# EAGLE schematic schematic (EAGLE 9.6.2)

## Sheet 1 of 8: Connections
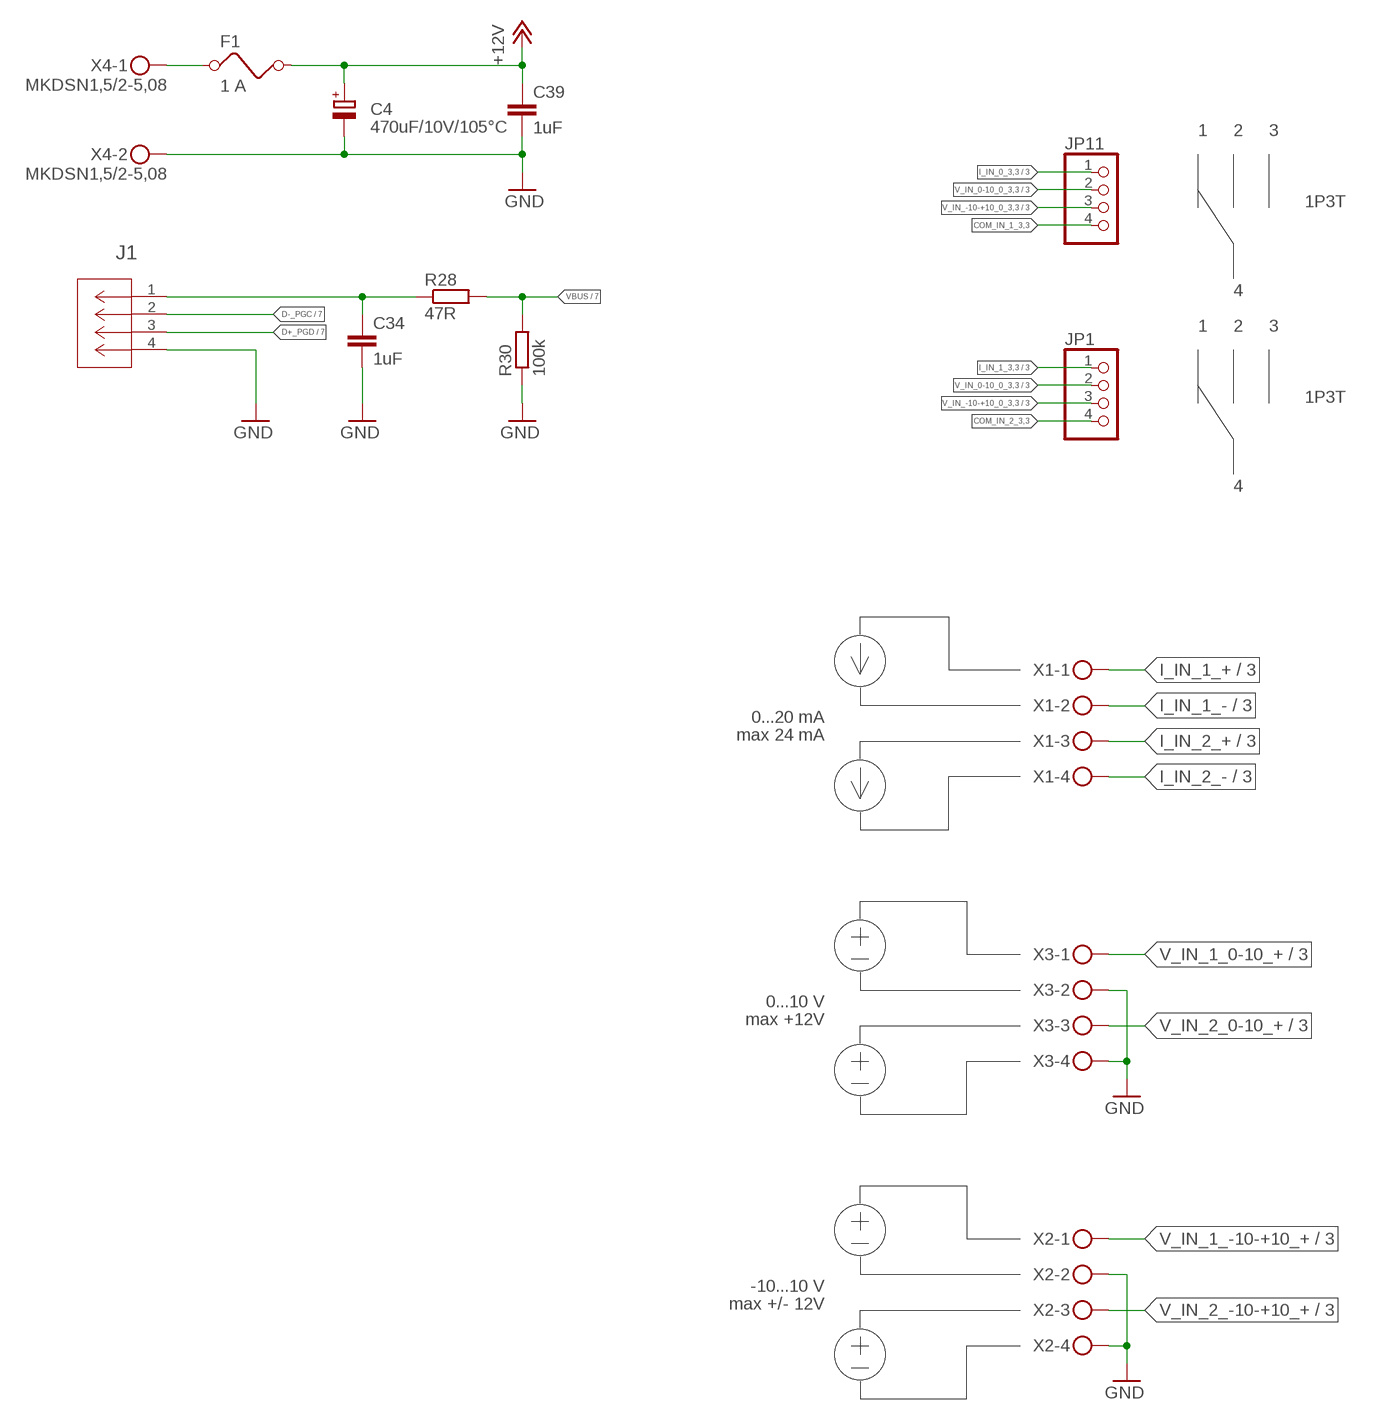
[diagram p0: schematic, sheet 1]

### Parts
C4  470uF/10V/105°C  CPOL-EUE3.5-8  [E3,5-8]
C34  1uF  C-EUC0805  [C0805]
C39  1uF  C-EUC0805  [C0805]
F1  1 A  FUSE  [FUSE]
J1  USB-B  [CONN_67068-8000_MOL]
JP1  PINHD-1X4  [1X04]
JP11  PINHD-1X4  [1X04]
R28  47R  R-EU_M0805  [M0805]
R30  100k  R-EU_M0805  [M0805]
X1  MKDSN1,5/4-5,08  [MKDSN1,5/4-5,08]
X2  MKDSN1,5/4-5,08  [MKDSN1,5/4-5,08]
X3  MKDSN1,5/4-5,08  [MKDSN1,5/4-5,08]
X4  MKDSN1,5/2-5,08  [MKDSN1,5/2-5,08]

### Nets
+12V: C4.+ C39.1 F1.2 ; also sheet 3,4,8
COM_IN_1_3,3: JP11.4
COM_IN_2_3,3: JP1.4
D+_PGD: J1.3 ; also sheet 7
D-_PGC: J1.2 ; also sheet 7
GND: C4.- C34.2 C39.2 J1.4 R30.1 X2.2 X2.4 X3.2 X3.4 X4.2 ; also sheet 2,3,4,5,6,7,8
I_IN_0_3,3: JP11.1 ; also sheet 3,7
I_IN_1_3,3: JP1.1 ; also sheet 3,7
I_IN_1_+: X1.1 ; also sheet 3
I_IN_1_-: X1.2 ; also sheet 3
I_IN_2_+: X1.3 ; also sheet 3
I_IN_2_-: X1.4 ; also sheet 3
N$12: C34.1 J1.1 R28.1
N$22: F1.1 X4.1
V_IN_0-10_0_3,3: JP1.2 JP11.2 ; also sheet 3,7
V_IN_1_0-10_+: X3.1 ; also sheet 3
V_IN_1_-10-+10_+: X2.1 ; also sheet 3
V_IN_2_0-10_+: X3.3 ; also sheet 3
V_IN_2_-10-+10_+: X2.3 ; also sheet 3
V_IN_-10-+10_0_3,3: JP1.3 JP11.3 ; also sheet 3,7
VBUS: R28.2 R30.2 ; also sheet 7

### Notes on the sheet
- 1 | 2 | 3
- 1P3T
- 4
- 1 | 2 | 3
- 1P3T
- 4
- 0...20 mA
- max 24 mA
- 0...10 V
- max +12V
- -10...10 V
- max +/- 12V

## Sheet 2 of 8: Voltage References
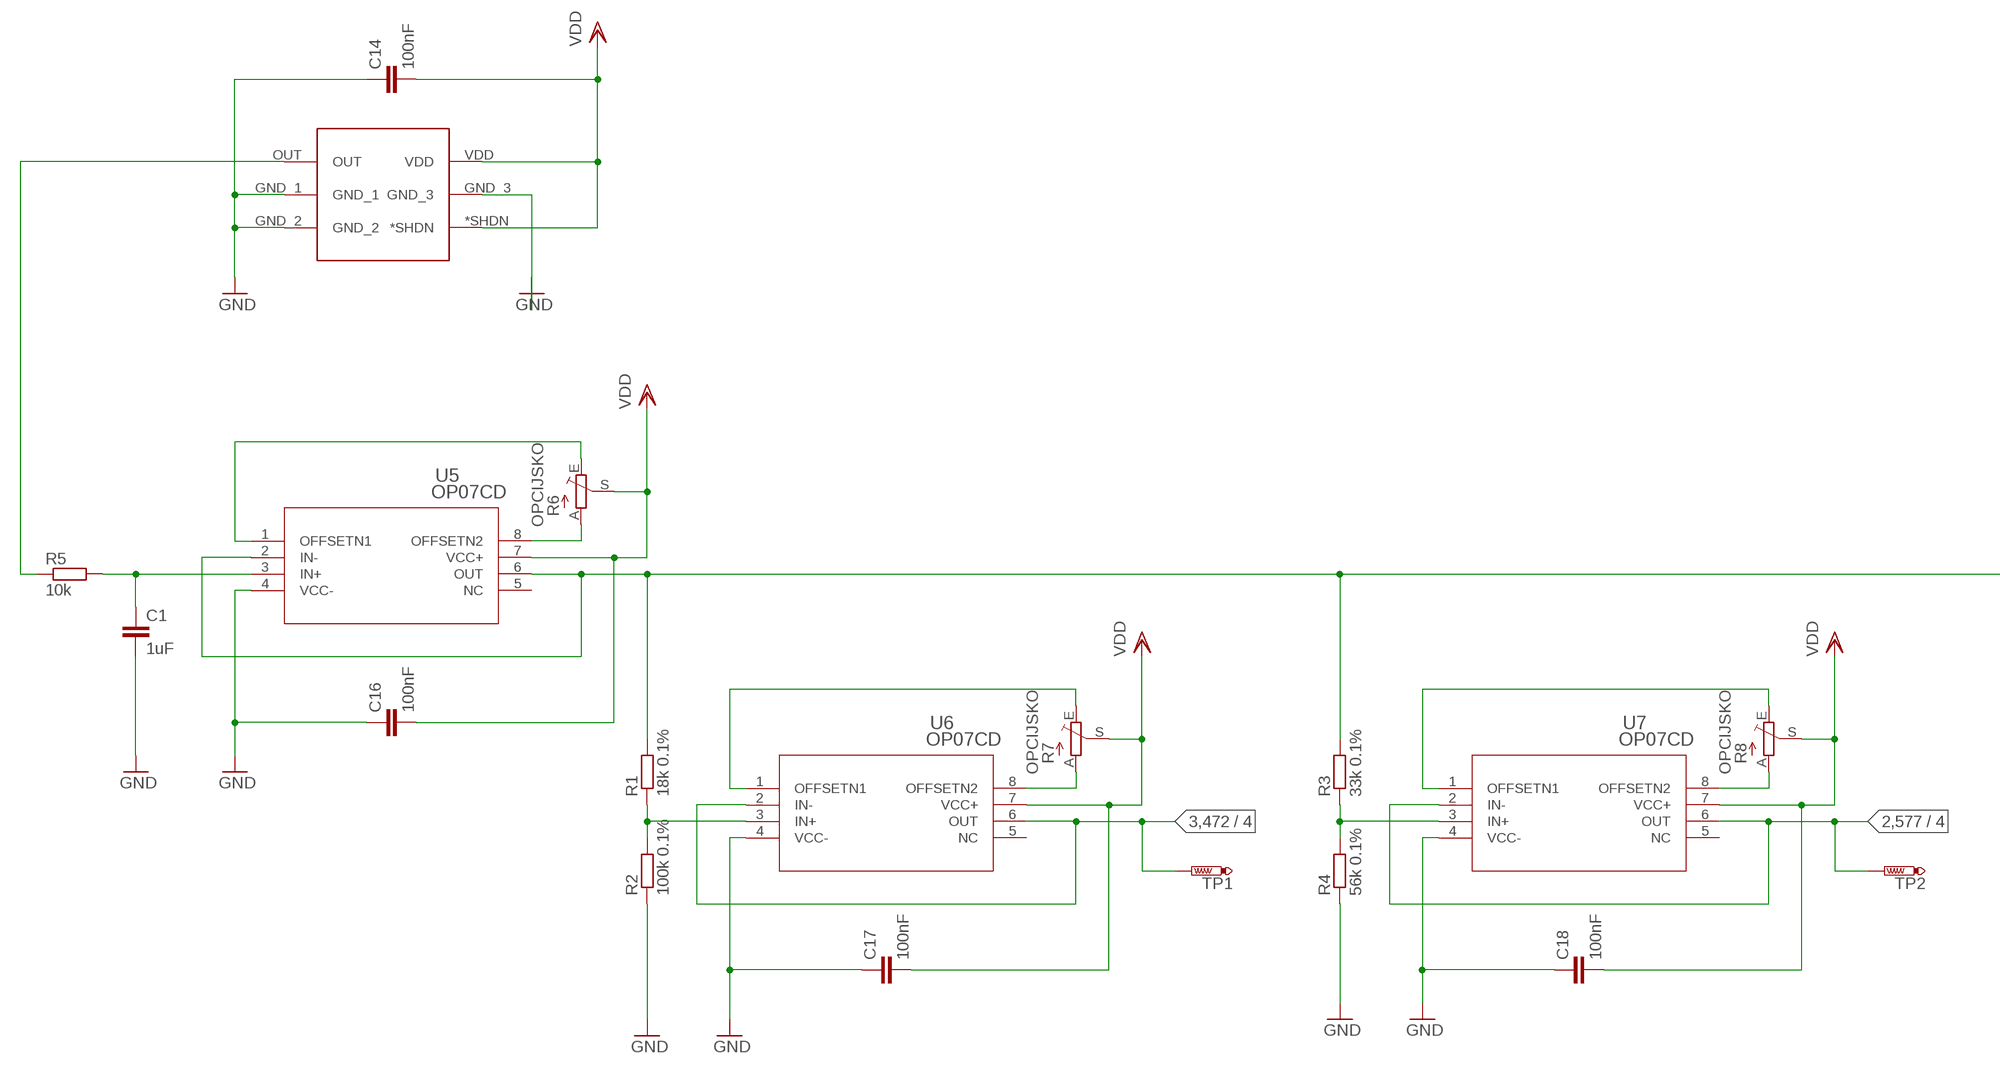
[diagram p1: schematic, sheet 2, part 1 of 2]
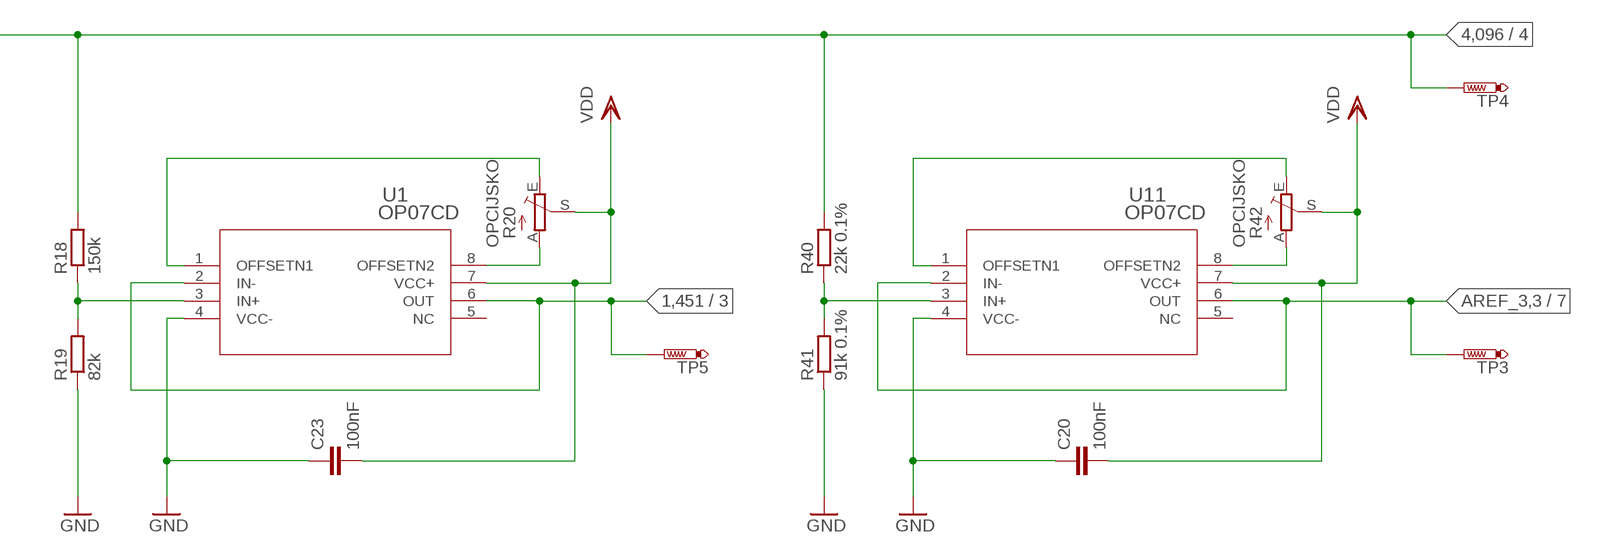
[diagram p2: schematic, sheet 2, part 2 of 2]

### Parts
C1  1uF  C-EUC0805  [C0805]
C14  100nF  C-EUC0805  [C0805]
C16  100nF  C-EUC0805  [C0805]
C17  100nF  C-EUC0805  [C0805]
C18  100nF  C-EUC0805  [C0805]
C20  100nF  C-EUC0805  [C0805]
C23  100nF  C-EUC0805  [C0805]
R1  18k 0.1%  R-EU_R0805  [R0805]
R2  100k 0.1%  R-EU_R0805  [R0805]
R3  33k 0.1%  R-EU_R0805  [R0805]
R4  56k 0.1%  R-EU_R0805  [R0805]
R5  10k  R-EU_R0805  [R0805]
R6  TRIM_EU-S64W  [S64W]
R7  TRIM_EU-S64W  [S64W]
R8  TRIM_EU-S64W  [S64W]
R18  150k  R-EU_R0805  [R0805]
R19  82k  R-EU_R0805  [R0805]
R20  TRIM_EU-S64W  [S64W]
R40  22k 0.1%  R-EU_R0805  [R0805]
R41  91k 0.1%  R-EU_R0805  [R0805]
R42  TRIM_EU-S64W  [S64W]
TP1  PTR1PAD1-13  [P1-13]
TP2  PTR1PAD1-13  [P1-13]
TP3  PTR1PAD1-13  [P1-13]
TP4  PTR1PAD1-13  [P1-13]
TP5  PTR1PAD1-13  [P1-13]
U1  OP07CD  [D8]
U4  MCP1501T-40E/CHY  [SOT26]
U5  OP07CD  [D8]
U6  OP07CD  [D8]
U7  OP07CD  [D8]
U11  OP07CD  [D8]

### Nets
1,451: TP5.TP U1.2(IN-) U1.6(OUT) ; also sheet 3
2,577: TP2.TP U7.2(IN-) U7.6(OUT) ; also sheet 4
3,472: TP1.TP U6.2(IN-) U6.6(OUT) ; also sheet 4
4,096: R1.2 R3.2 R18.2 R40.2 TP4.TP U5.2(IN-) U5.6(OUT) ; also sheet 4
AREF_3,3: TP3.TP U11.2(IN-) U11.6(OUT) ; also sheet 3,7
GND: C1.2 C14.1 C16.1 C17.1 C18.1 C20.1 C23.1 R2.1 R4.1 R19.1 R41.1 U1.4(VCC-) U4.GND_1 U4.GND_2 U4.GND_3 U5.4(VCC-) U6.4(VCC-) U7.4(VCC-) U11.4(VCC-) ; also sheet 1,3,4,5,6,7,8
N$1: R3.1 R4.2 U7.3(IN+)
N$2: R6.A U5.8(OFFSETN2)
N$3: C1.1 R5.2 U5.3(IN+)
N$4: R6.E U5.1(OFFSETN1)
N$5: R5.1 U4.OUT
N$6: R1.1 R2.2 U6.3(IN+)
N$7: R7.A U6.8(OFFSETN2)
N$8: R7.E U6.1(OFFSETN1)
N$9: R8.A U7.8(OFFSETN2)
N$10: R8.E U7.1(OFFSETN1)
N$23: R18.1 R19.2 U1.3(IN+)
N$24: R20.A U1.8(OFFSETN2)
N$27: R20.E U1.1(OFFSETN1)
N$40: R40.1 R41.2 U11.3(IN+)
N$44: R42.A U11.8(OFFSETN2)
N$45: R42.E U11.1(OFFSETN1)
VDD: C14.2 C16.2 C17.2 C18.2 C20.2 C23.2 R6.S R7.S R8.S R20.S R42.S U1.7(VCC+) U4.*SHDN U4.VDD U5.7(VCC+) U6.7(VCC+) U7.7(VCC+) U11.7(VCC+) ; also sheet 3,4,8
Unconnected: U1.5(NC) U5.5(NC) U6.5(NC) U7.5(NC) U11.5(NC)

### Notes on the sheet
- OPCIJSKO
- OPCIJSKO | OPCIJSKO | OPCIJSKO | OPCIJSKO

## Sheet 3 of 8: Analog inputs
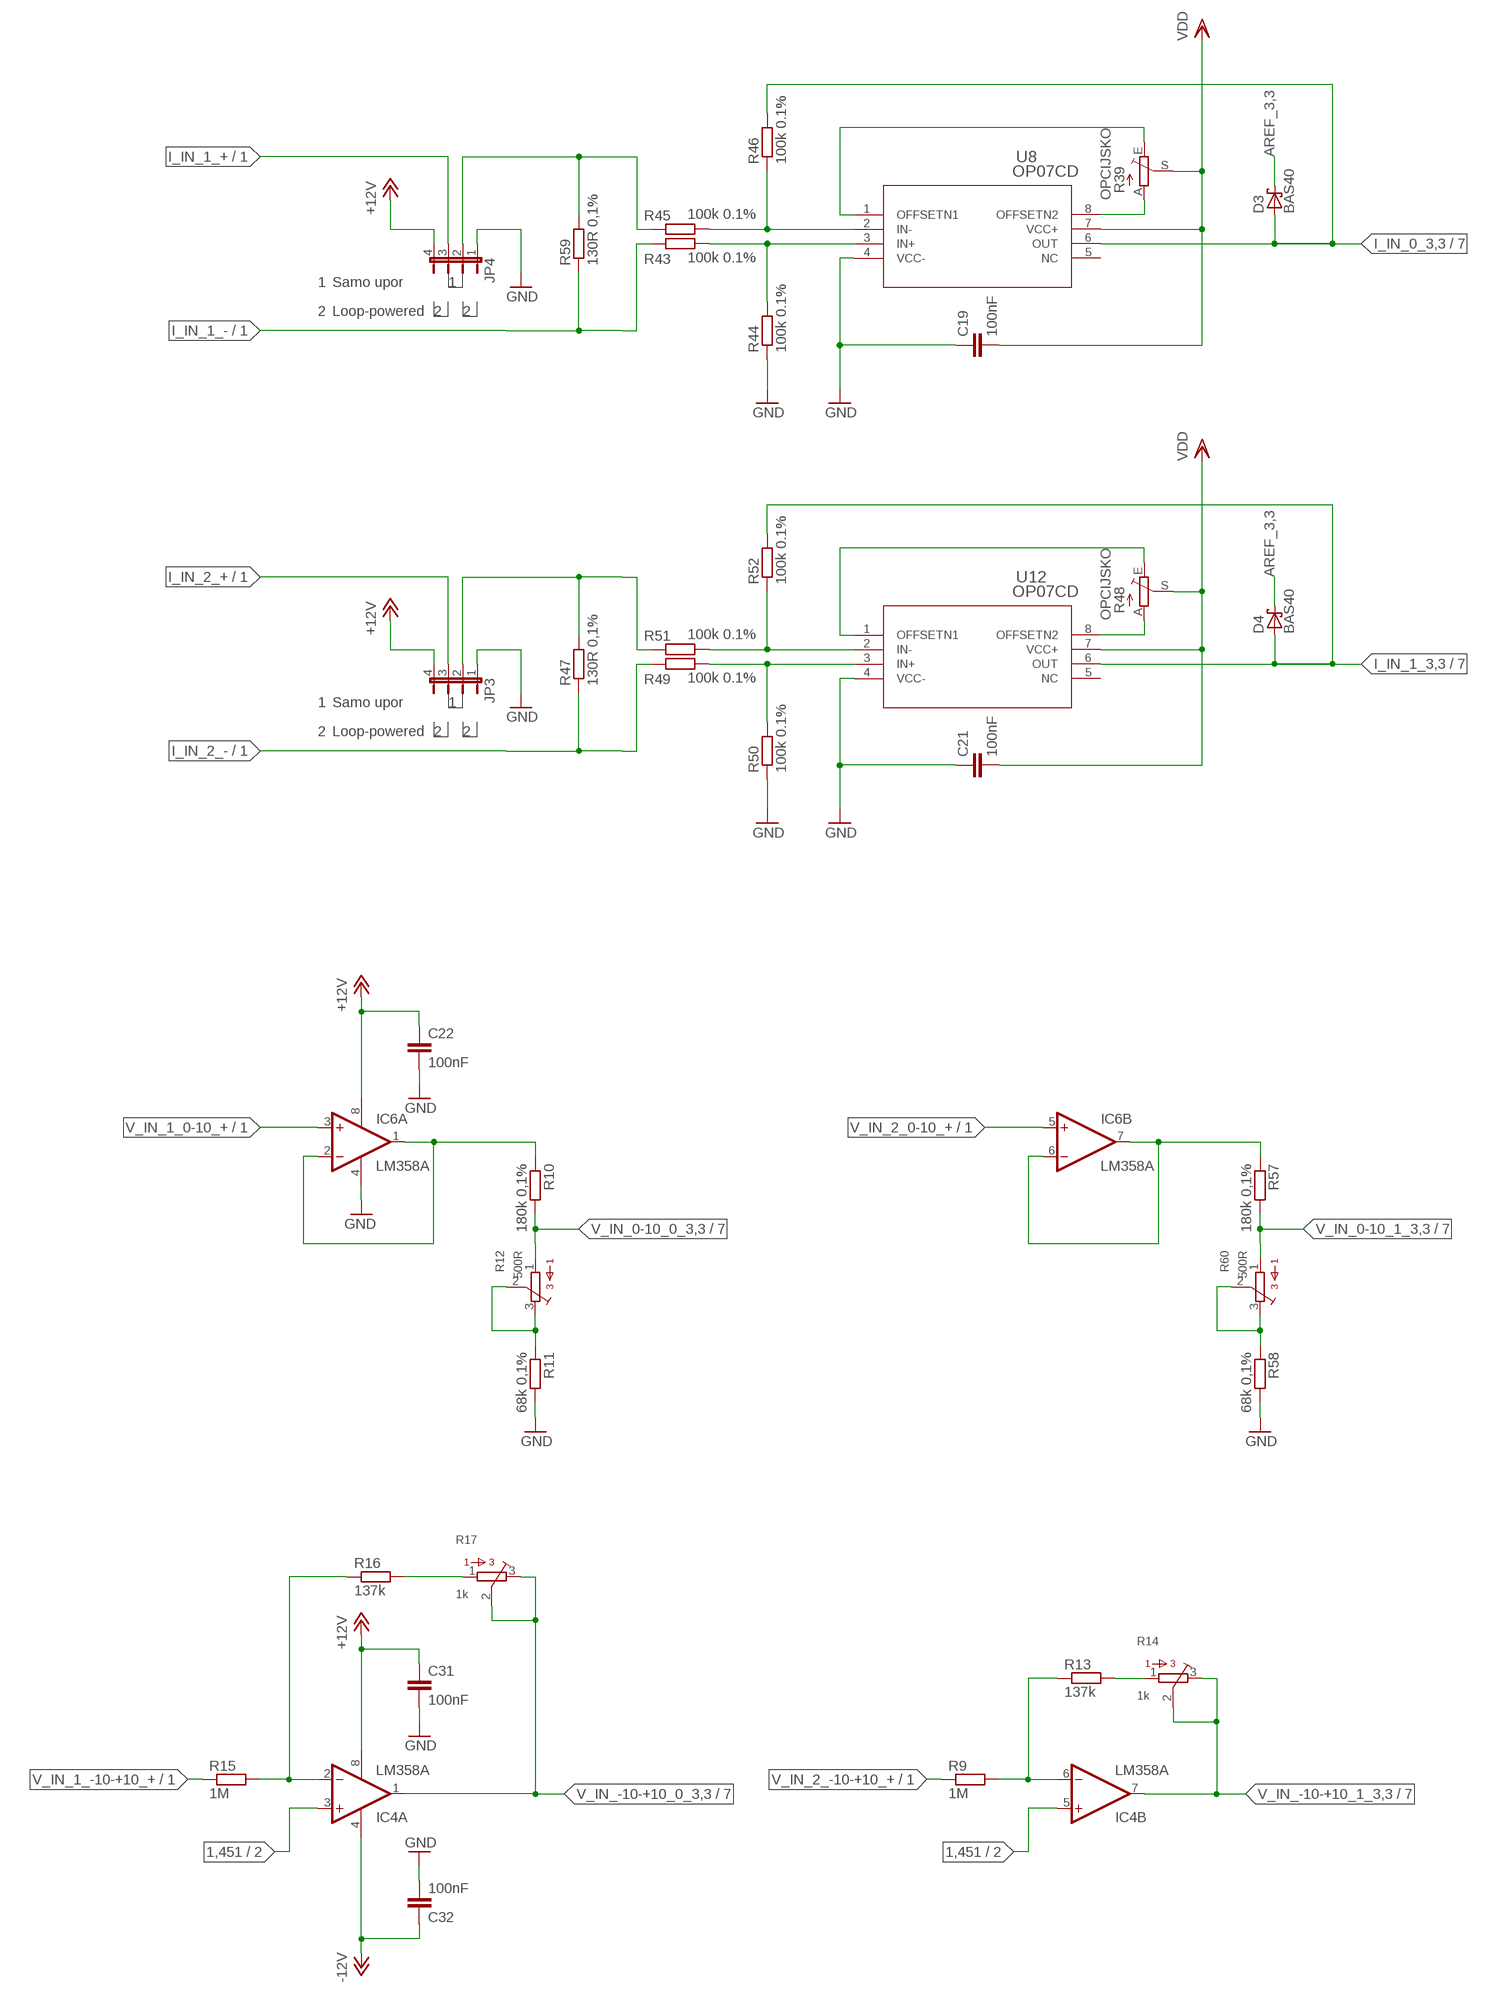
[diagram p3: schematic, sheet 3]

### Parts
C19  100nF  C-EUC0805  [C0805]
C21  100nF  C-EUC0805  [C0805]
C22  100nF  C-EUC0805  [C0805]
C31  100nF  C-EUC0805  [C0805]
C32  100nF  C-EUC0805  [C0805]
D3  BAS40  [SOT23]
D4  BAS40  [SOT23]
IC4  LM358A  LM358D  [SO08]
IC6  LM358A  LM358D  [SO08]
JP3  JP4E  [JP4]
JP4  JP4E  [JP4]
R9  1M  R-EU_R0805  [R0805]
R10  180k 0,1%  R-EU_R0805  [R0805]
R11  68k 0,1%  R-EU_R0805  [R0805]
R12  500R  3362P  [3362P]
R13  137k  R-EU_R0805  [R0805]
R14  1k  3362P  [3362P]
R15  1M  R-EU_R0805  [R0805]
R16  137k  R-EU_R0805  [R0805]
R17  1k  3362P  [3362P]
R39  TRIM_EU-S64W  [S64W]
R43  100k 0.1%  R-EU_R0805  [R0805]
R44  100k 0.1%  R-EU_R0805  [R0805]
R45  100k 0.1%  R-EU_R0805  [R0805]
R46  100k 0.1%  R-EU_R0805  [R0805]
R47  130R 0,1%  R-EU_R0805  [R0805]
R48  TRIM_EU-S64W  [S64W]
R49  100k 0.1%  R-EU_R0805  [R0805]
R50  100k 0.1%  R-EU_R0805  [R0805]
R51  100k 0.1%  R-EU_R0805  [R0805]
R52  100k 0.1%  R-EU_R0805  [R0805]
R57  180k 0,1%  R-EU_R0805  [R0805]
R58  68k 0,1%  R-EU_R0805  [R0805]
R59  130R 0,1%  R-EU_R0805  [R0805]
R60  500R  3362P  [3362P]
U8  OP07CD  [D8]
U12  OP07CD  [D8]

### Nets
1,451: IC4.3(A:+IN) IC4.5(B:+IN) ; also sheet 2
+12V: C22.1 C31.1 IC4.8(P:V+) IC6.8(P:V+) JP3.4 JP4.4 ; also sheet 1,4,8
-12V: C32.1 IC4.4(P:V-) ; also sheet 4,8
AREF_3,3: D3.3(C) D4.3(C) ; also sheet 2,7
GND: C19.1 C21.1 C22.2 C31.2 C32.2 IC6.4(P:V-) JP3.1 JP4.1 R11.2 R44.1 R50.1 R58.2 U8.4(VCC-) U12.4(VCC-) ; also sheet 1,2,4,5,6,7,8
I_IN_0_3,3: D3.1(A) R46.2 U8.6(OUT) ; also sheet 1,7
I_IN_1_3,3: D4.1(A) R52.2 U12.6(OUT) ; also sheet 1,7
I_IN_1_+: JP4.3 ; also sheet 1
I_IN_2_+: JP3.3 ; also sheet 1
N$14: R16.2 R17.1
N$20: IC4.2(A:-IN) R15.2 R16.1
N$25 [signal]: IC6.1(A:OUT) IC6.2(A:-IN) R10.1
N$26: R11.1 R12.2 R12.3
N$28: IC4.6(B:-IN) R9.2 R13.1
N$35: R13.2 R14.1
N$41: R39.A U8.8(OFFSETN2)
N$43: R39.E U8.1(OFFSETN1)
N$46: R45.1 R46.1 U8.2(IN-)
N$47: R43.2 R44.2 U8.3(IN+)
N$48 [signal]: JP3.2 R47.2 R51.2
N$49 [signal]: R47.1 R49.1
N$50: R48.A U12.8(OFFSETN2)
N$51: R48.E U12.1(OFFSETN1)
N$52: R51.1 R52.1 U12.2(IN-)
N$53: R49.2 R50.2 U12.3(IN+)
N$55: R58.1 R60.2 R60.3
N$89 [signal]: JP4.2 R45.2 R59.2
N$93 [signal]: IC6.6(B:-IN) IC6.7(B:OUT) R57.1
N$96 [signal]: R43.1 R59.1
V_IN_0-10_0_3,3: R10.2 R12.1 ; also sheet 1,7
V_IN_0-10_1_3,3: R57.2 R60.1 ; also sheet 7
V_IN_1_0-10_+: IC6.3(A:+IN) ; also sheet 1
V_IN_1_-10-+10_+: R15.1 ; also sheet 1
V_IN_2_0-10_+: IC6.5(B:+IN) ; also sheet 1
V_IN_2_-10-+10_+: R9.1 ; also sheet 1
V_IN_-10-+10_0_3,3: IC4.1(A:OUT) R17.2 R17.3 ; also sheet 1,7
V_IN_-10-+10_1_3,3: IC4.7(B:OUT) R14.2 R14.3 ; also sheet 7
VDD: C19.2 C21.2 R39.S R48.S U8.7(VCC+) U12.7(VCC+) ; also sheet 2,4,8
Unconnected: U8.5(NC) U12.5(NC)

### Notes on the sheet
- OPCIJSKO
- 1 | Samo upor | 1
- 2 | Loop-powered | 2 | 2
- OPCIJSKO
- 1 | Samo upor | 1
- 2 | Loop-powered | 2 | 2

## Sheet 4 of 8: Analog Outputs
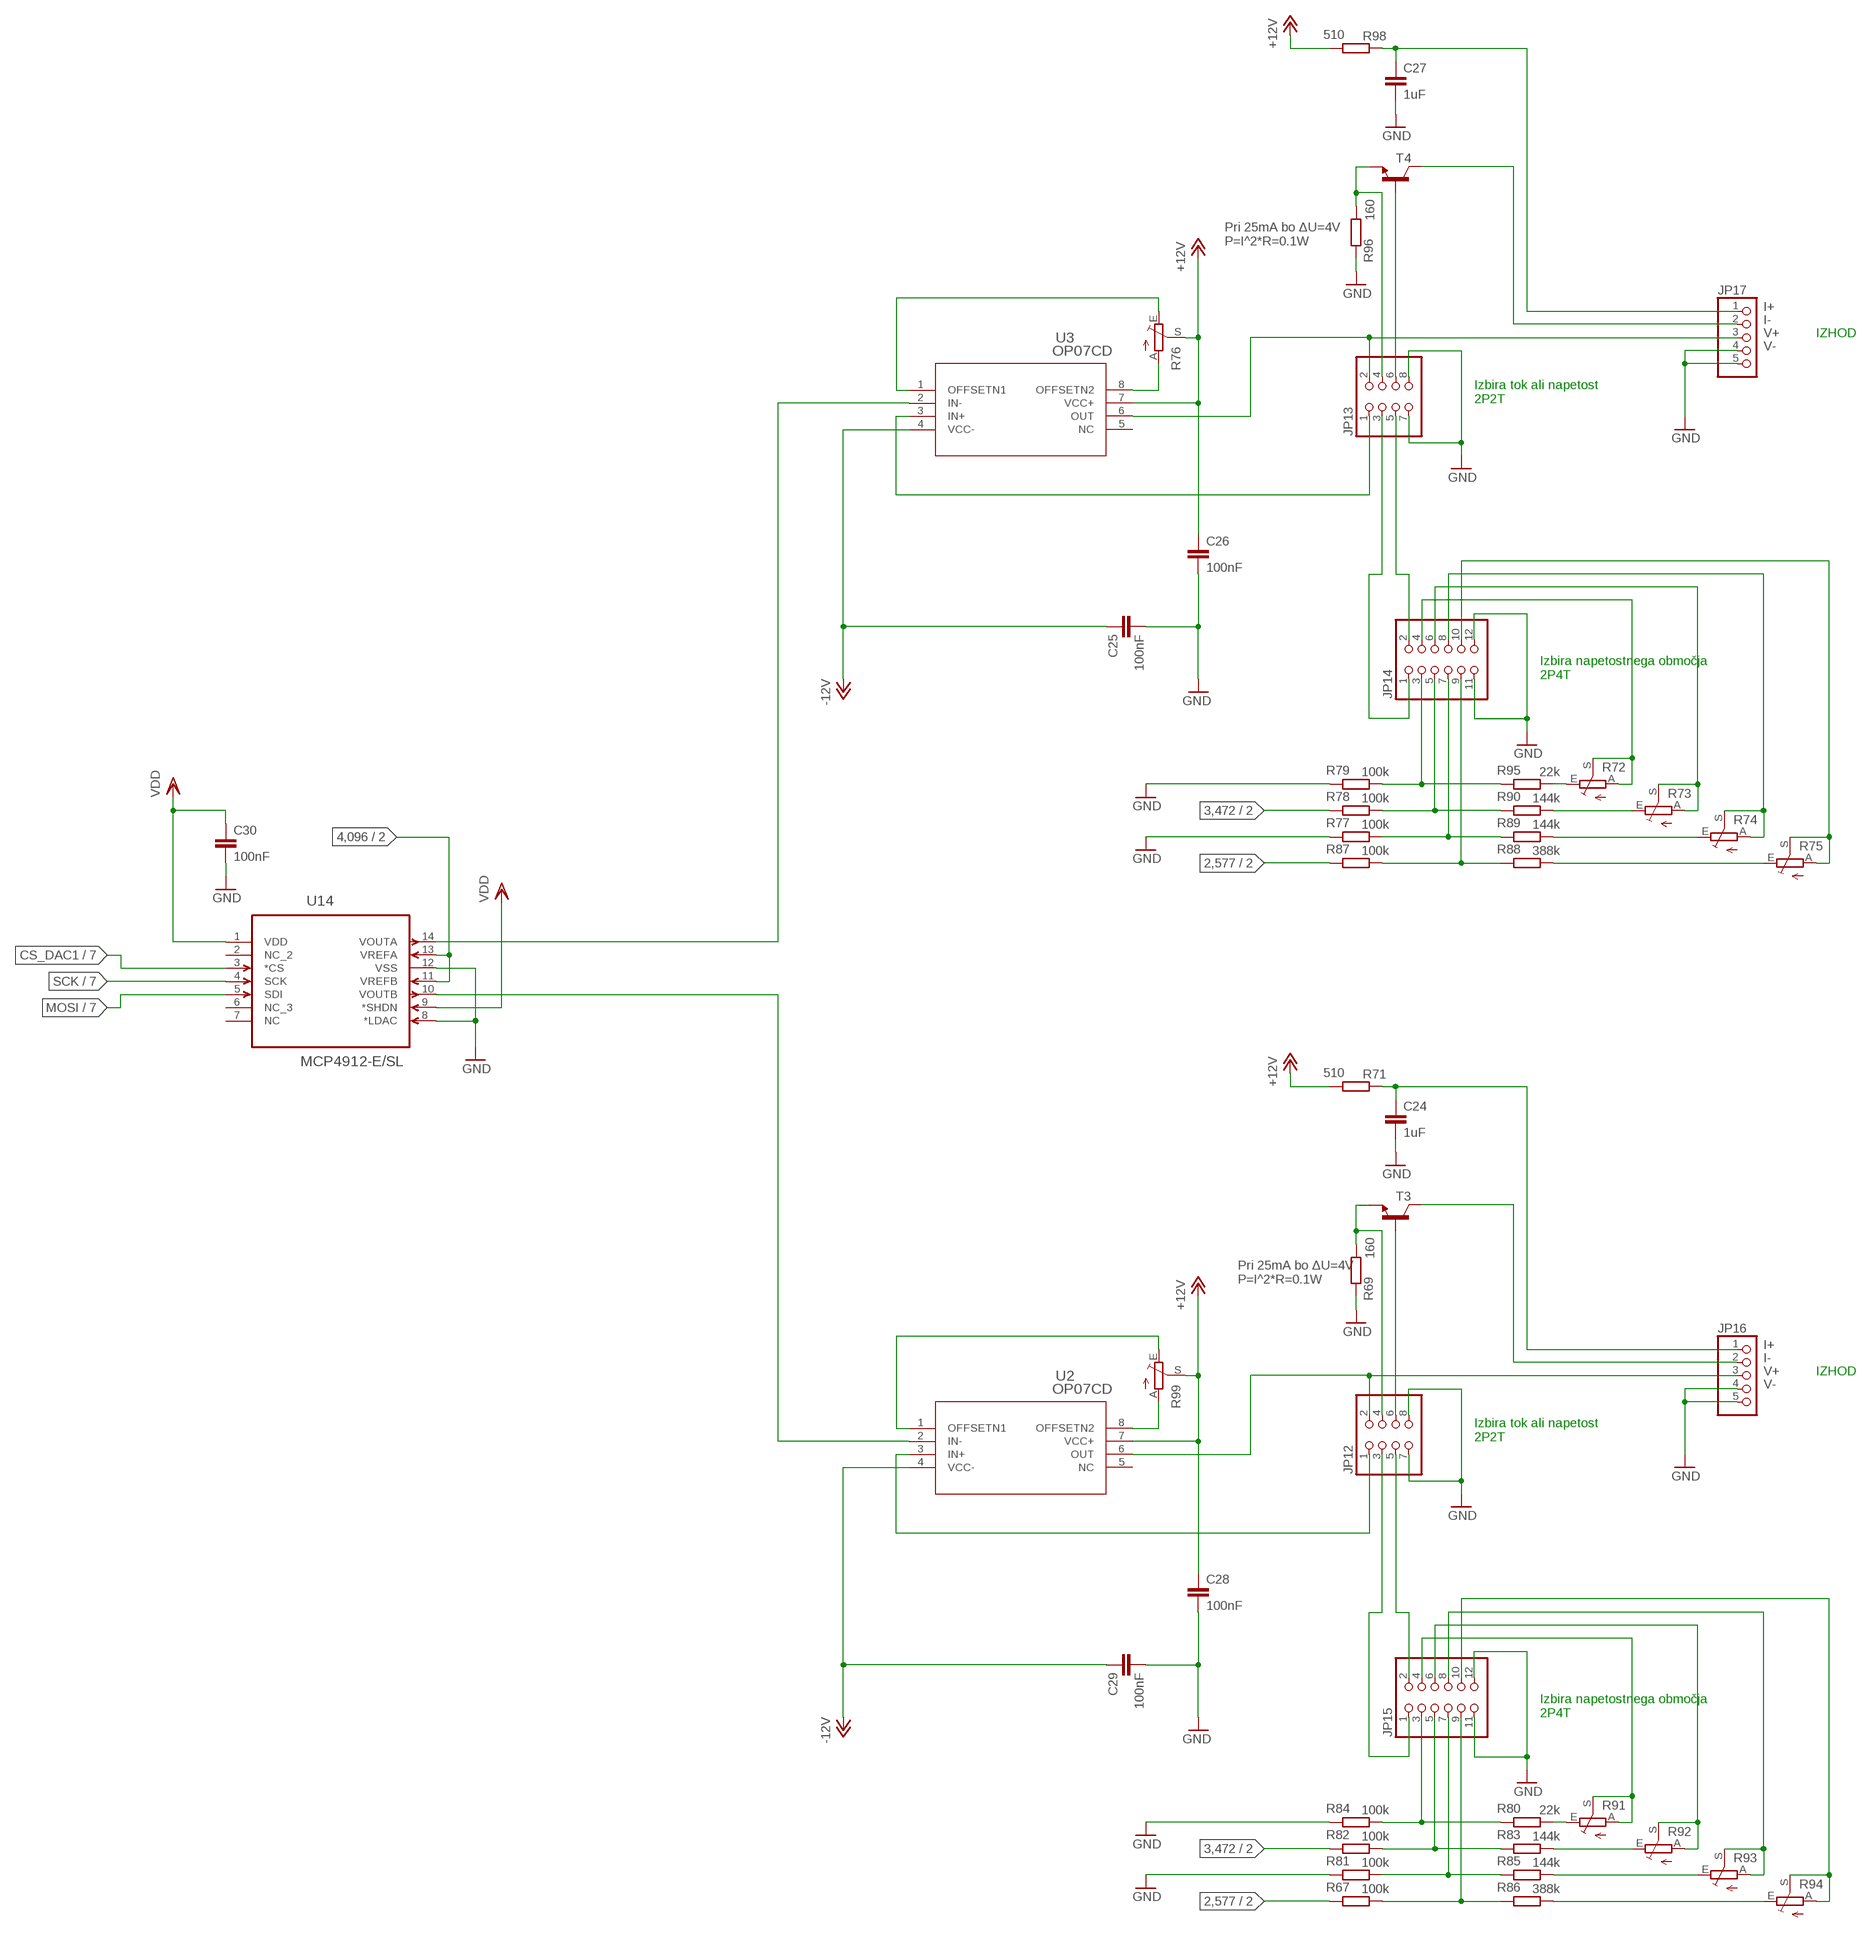
[diagram p4: schematic, sheet 4]

### Parts
C24  1uF  C-EUC0805  [C0805]
C25  100nF  C-EUC0805  [C0805]
C26  100nF  C-EUC0805  [C0805]
C27  1uF  C-EUC0805  [C0805]
C28  100nF  C-EUC0805  [C0805]
C29  100nF  C-EUC0805  [C0805]
C30  100nF  C-EUC0805  [C0805]
JP12  PINHD-2X4  [2X04]
JP13  PINHD-2X4  [2X04]
JP14  PINHD-2X6  [2X06]
JP15  PINHD-2X6  [2X06]
JP16  PINHD-1X5  [1X05]
JP17  PINHD-1X5  [1X05]
R67  100k  R-EU_R0805  [R0805]
R69  160  R-EU_R0805  [R0805]
R71  510  R-EU_R0805  [R0805]
R72  TRIM_EU-S64W  [S64W]
R73  TRIM_EU-S64W  [S64W]
R74  TRIM_EU-S64W  [S64W]
R75  TRIM_EU-S64W  [S64W]
R76  TRIM_EU-S64W  [S64W]
R77  100k  R-EU_R0805  [R0805]
R78  100k  R-EU_R0805  [R0805]
R79  100k  R-EU_R0805  [R0805]
R80  22k  R-EU_R0805  [R0805]
R81  100k  R-EU_R0805  [R0805]
R82  100k  R-EU_R0805  [R0805]
R83  144k  R-EU_R0805  [R0805]
R84  100k  R-EU_R0805  [R0805]
R85  144k  R-EU_R0805  [R0805]
R86  388k  R-EU_R0805  [R0805]
R87  100k  R-EU_R0805  [R0805]
R88  388k  R-EU_R0805  [R0805]
R89  144k  R-EU_R0805  [R0805]
R90  144k  R-EU_R0805  [R0805]
R91  TRIM_EU-S64W  [S64W]
R92  TRIM_EU-S64W  [S64W]
R93  TRIM_EU-S64W  [S64W]
R94  TRIM_EU-S64W  [S64W]
R95  22k  R-EU_R0805  [R0805]
R96  160  R-EU_R0805  [R0805]
R98  510  R-EU_R0805  [R0805]
R99  TRIM_EU-S64W  [S64W]
T3  MMBT3904LT1-NPN-SOT23-BEC  [SOT23-BEC]
T4  MMBT3904LT1-NPN-SOT23-BEC  [SOT23-BEC]
U2  OP07CD  [D8]
U3  OP07CD  [D8]
U14  MCP4912-E/SL  [SOIC127P600X175-16N]

### Nets
2,577: R67.2 R87.2 ; also sheet 2
3,472: R78.2 R82.2 ; also sheet 2
4,096: U14.11(VREFB) U14.13(VREFA) ; also sheet 2
+12V: C26.1 C28.1 R71.1 R76.S R98.1 R99.S U2.7(VCC+) U3.7(VCC+) ; also sheet 1,3,8
-12V: C25.1 C29.1 U2.4(VCC-) U3.4(VCC-) ; also sheet 3,8
CS_DAC1: U14.3(*CS) ; also sheet 7
GND: C24.2 C25.2 C26.2 C27.2 C28.2 C29.2 C30.2 JP12.7 JP12.8 JP13.7 JP13.8 JP14.11 JP14.12 JP15.11 JP15.12 R69.2 R77.2 R79.2 R81.2 R84.2 R96.2 U14.8(*LDAC) U14.12(VSS) ; also sheet 1,2,3,5,6,7,8
I+: C24.1 C27.1 JP16.1 JP17.1 R71.2 R98.2
I-: JP16.2 JP17.2 T3.C T4.C
MOSI: U14.5(SDI) ; also sheet 7
N$59: R99.A U2.8(OFFSETN2)
N$64: U14.14(VOUTA)
N$65: U3.2(IN-)
N$66: U2.2(IN-) U14.10(VOUTB)
N$68: JP13.4 R96.1 T4.E
N$71: JP14.3 R79.1 R95.2
N$72: JP14.7 R77.1 R89.2
N$73: JP14.9 R87.1 R88.2
N$74: JP14.5 R78.1 R90.2
N$75: JP13.1 U3.3(IN+)
N$76: JP13.3 JP14.1
N$77: JP13.5 JP14.2
N$78: JP13.6 T4.B
N$79: R72.E R95.1
N$80: JP14.6 R73.A R73.S
N$81: JP14.4 R72.A R72.S
N$85: JP12.4 R69.1 T3.E
N$86: JP15.3 R80.2 R84.1
N$87: JP15.7 R81.1 R85.2
N$88: JP15.9 R67.1 R86.2
N$90: JP15.5 R82.1 R83.2
N$91: JP12.1 U2.3(IN+)
N$92: JP12.3 JP15.1
N$94: JP12.5 JP15.2
N$95: JP12.6 T3.B
N$97: R80.1 R91.E
N$98: JP15.6 R92.A R92.S
N$99: JP15.4 R91.A R91.S
N$100: JP15.8 R93.A R93.S
N$101: JP15.10 R94.A R94.S
N$102: R83.1 R92.E
N$103: R85.1 R93.E
N$104: R86.1 R94.E
N$105: JP14.8 R74.A R74.S
N$106: JP14.10 R75.A R75.S
N$107: R73.E R90.1
N$108: R74.E R89.1
N$109: R99.E U2.1(OFFSETN1)
N$110: R75.E R88.1
N$111: R76.A U3.8(OFFSETN2)
N$112: R76.E U3.1(OFFSETN1)
SCK: U14.4(SCK) ; also sheet 7
V+: JP12.2 JP13.2 JP16.3 JP17.3 U2.6(OUT) U3.6(OUT)
V-: JP16.4 JP16.5 JP17.4 JP17.5 ; supply symbol labelled GND
VDD: C30.1 U14.1(VDD) U14.9(*SHDN) ; also sheet 2,3,8
Unconnected: U2.5(NC) U3.5(NC) U14.2(NC_2) U14.6(NC_3) U14.7(NC)

### Notes on the sheet
- Pri 25mA bo ΔU=4V
  P=I^2*R=0.1W
- IZHOD
- Izbira tok ali napetost
  2P2T
- Izbira napetostnega območja
  2P4T
- Pri 25mA bo ΔU=4V
  P=I^2*R=0.1W
- IZHOD
- Izbira tok ali napetost
  2P2T
- Izbira napetostnega območja
  2P4T

## Sheet 5 of 8: Digital inputs
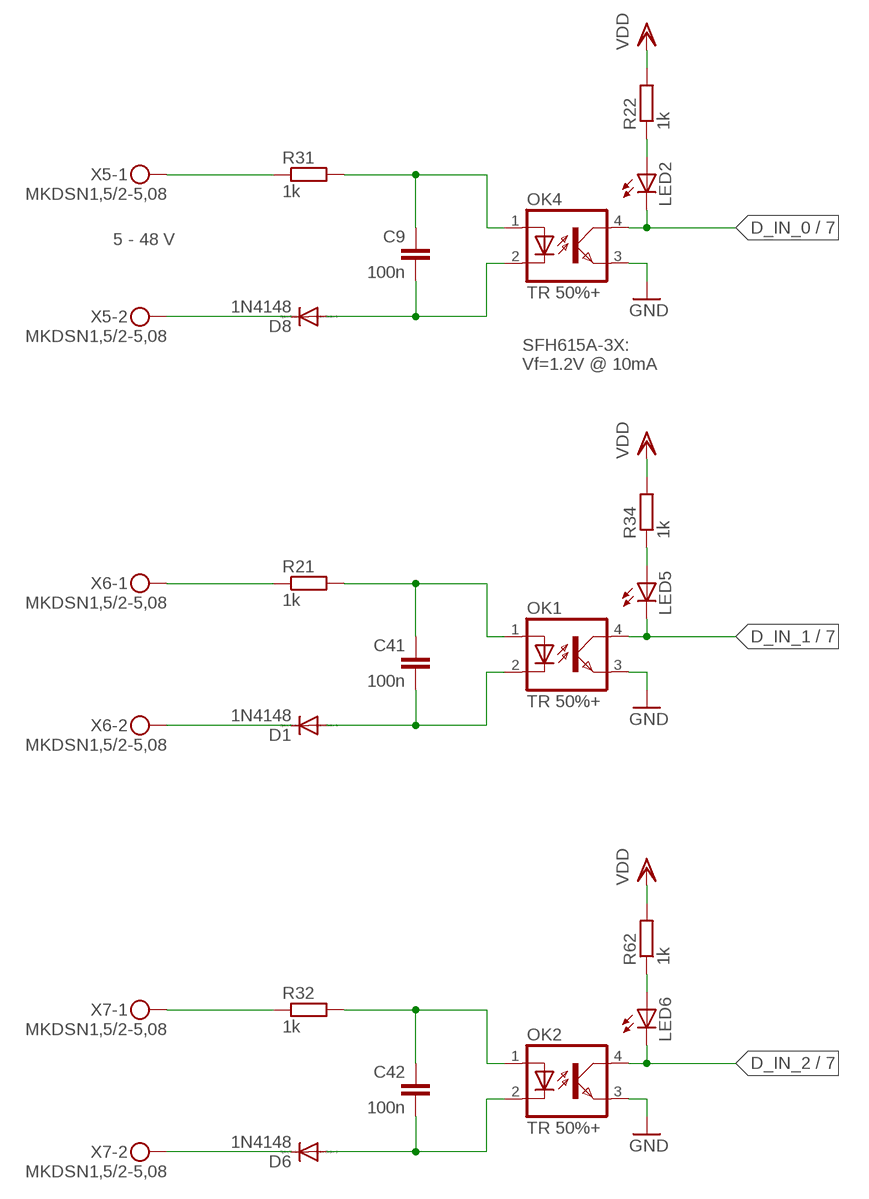
[diagram p5: schematic, sheet 5]

### Parts
C9  100n  C-EUC0805  [C0805]
C41  100n  C-EUC0805  [C0805]
C42  100n  C-EUC0805  [C0805]
D1  1N4148  [MINIMELF]
D6  1N4148  [MINIMELF]
D8  1N4148  [MINIMELF]
LED2  LEDCHIPLED_0805  [CHIPLED_0805]
LED5  LEDCHIPLED_0805  [CHIPLED_0805]
LED6  LEDCHIPLED_0805  [CHIPLED_0805]
OK1  TR 50%+  LTV816  [DIL04]
OK2  TR 50%+  LTV816  [DIL04]
OK4  TR 50%+  LTV816  [DIL04]
R21  1k  R-EU_R2512  [R2512]
R22  1k  R-EU_R0805  [R0805]
R31  1k  R-EU_R2512  [R2512]
R32  1k  R-EU_R2512  [R2512]
R34  1k  R-EU_R0805  [R0805]
R62  1k  R-EU_R0805  [R0805]
X5  MKDSN1,5/2-5,08  [MKDSN1,5/2-5,08]
X6  MKDSN1,5/2-5,08  [MKDSN1,5/2-5,08]
X7  MKDSN1,5/2-5,08  [MKDSN1,5/2-5,08]

### Nets
+5V [signal]: R22.2 R34.2 R62.2 ; supply symbol labelled VDD ; also sheet 8
D_IN_0: LED2.C OK4.4(COL) ; also sheet 7
D_IN_1: LED5.C OK1.4(COL) ; also sheet 7
D_IN_2: LED6.C OK2.4(COL) ; also sheet 7
GND: OK1.3(EMIT) OK2.3(EMIT) OK4.3(EMIT) ; also sheet 1,2,3,4,6,7,8
N$13: R21.1 X6.1
N$16 [signal]: LED2.A R22.1
N$17: C41.1 OK1.1(A) R21.2
N$21: C41.2 D1.A OK1.2(C)
N$29: D1.C X6.2
N$30 [signal]: LED5.A R34.1
N$36: R31.1 X5.1
N$39: C9.2 D8.A OK4.2(C)
N$54: R32.1 X7.1
N$56 [signal]: LED6.A R62.1
N$57: C42.1 OK2.1(A) R32.2
N$61: C42.2 D6.A OK2.2(C)
N$67: D6.C X7.2
N$84: C9.1 OK4.1(A) R31.2
N$123: D8.C X5.2

### Notes on the sheet
- 5 - 48 V
- SFH615A-3X:
  Vf=1.2V @ 10mA

## Sheet 6 of 8: Digital Outputs
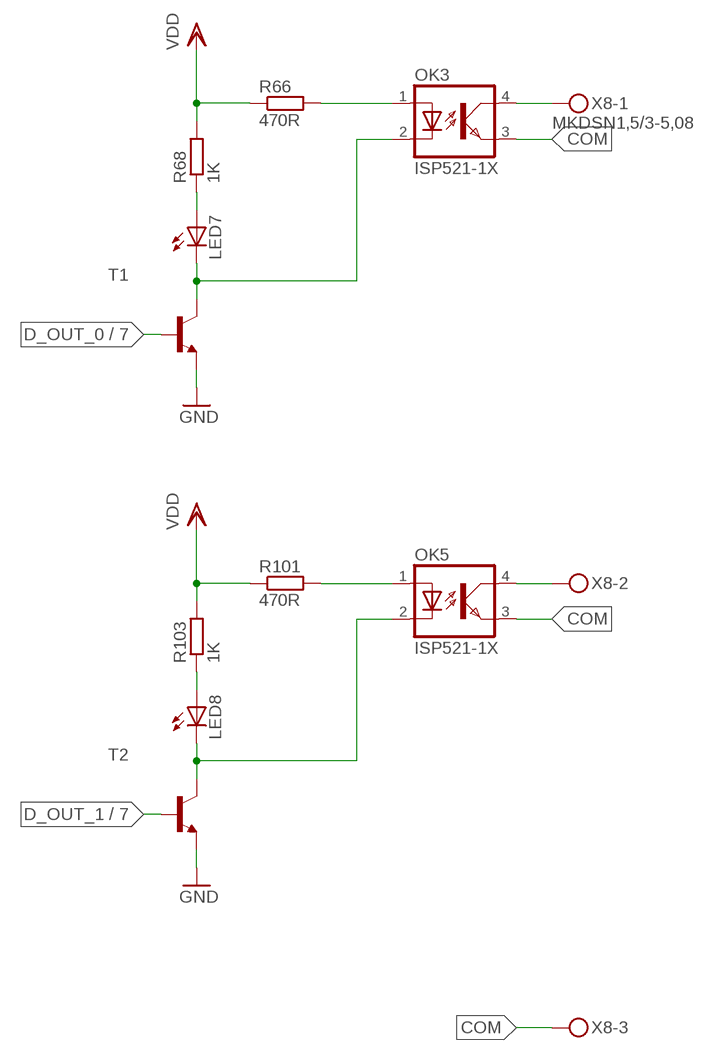
[diagram p6: schematic, sheet 6]

### Parts
LED7  LEDCHIPLED_0805  [CHIPLED_0805]
LED8  LEDCHIPLED_0805  [CHIPLED_0805]
OK3  ISP521-1X  LTV816  [DIL04]
OK5  ISP521-1X  LTV816  [DIL04]
R66  470R  R-EU_R0805  [R0805]
R68  1K  R-EU_R0805  [R0805]
R101  470R  R-EU_R0805  [R0805]
R103  1K  R-EU_R0805  [R0805]
T1  MMBT3904LT1-NPN-SOT23-BEC  [SOT23-BEC]
T2  MMBT3904LT1-NPN-SOT23-BEC  [SOT23-BEC]
X8  MKDSN1,5/3-5,08  [MKDSN1,5/3-5,08]

### Nets
COM [signal]: OK3.3(EMIT) OK5.3(EMIT) X8.3
D_OUT_0: T1.B ; also sheet 7
D_OUT_1: T2.B ; also sheet 7
GND: T1.E T2.E ; also sheet 1,2,3,4,5,7,8
N$18 [signal]: OK3.1(A) R66.2
N$37: OK3.4(COL) X8.1
N$62 [signal]: LED7.A R68.1
N$63 [signal]: LED7.C OK3.2(C) T1.C
N$113 [signal]: OK5.1(A) R101.2
N$114: OK5.4(COL) X8.2
N$116 [signal]: LED8.A R103.1
N$118 [signal]: LED8.C OK5.2(C) T2.C
VCC [signal]: R66.1 R68.2 R101.1 R103.2 ; supply symbol labelled VDD

## Sheet 7 of 8: Microprocessor
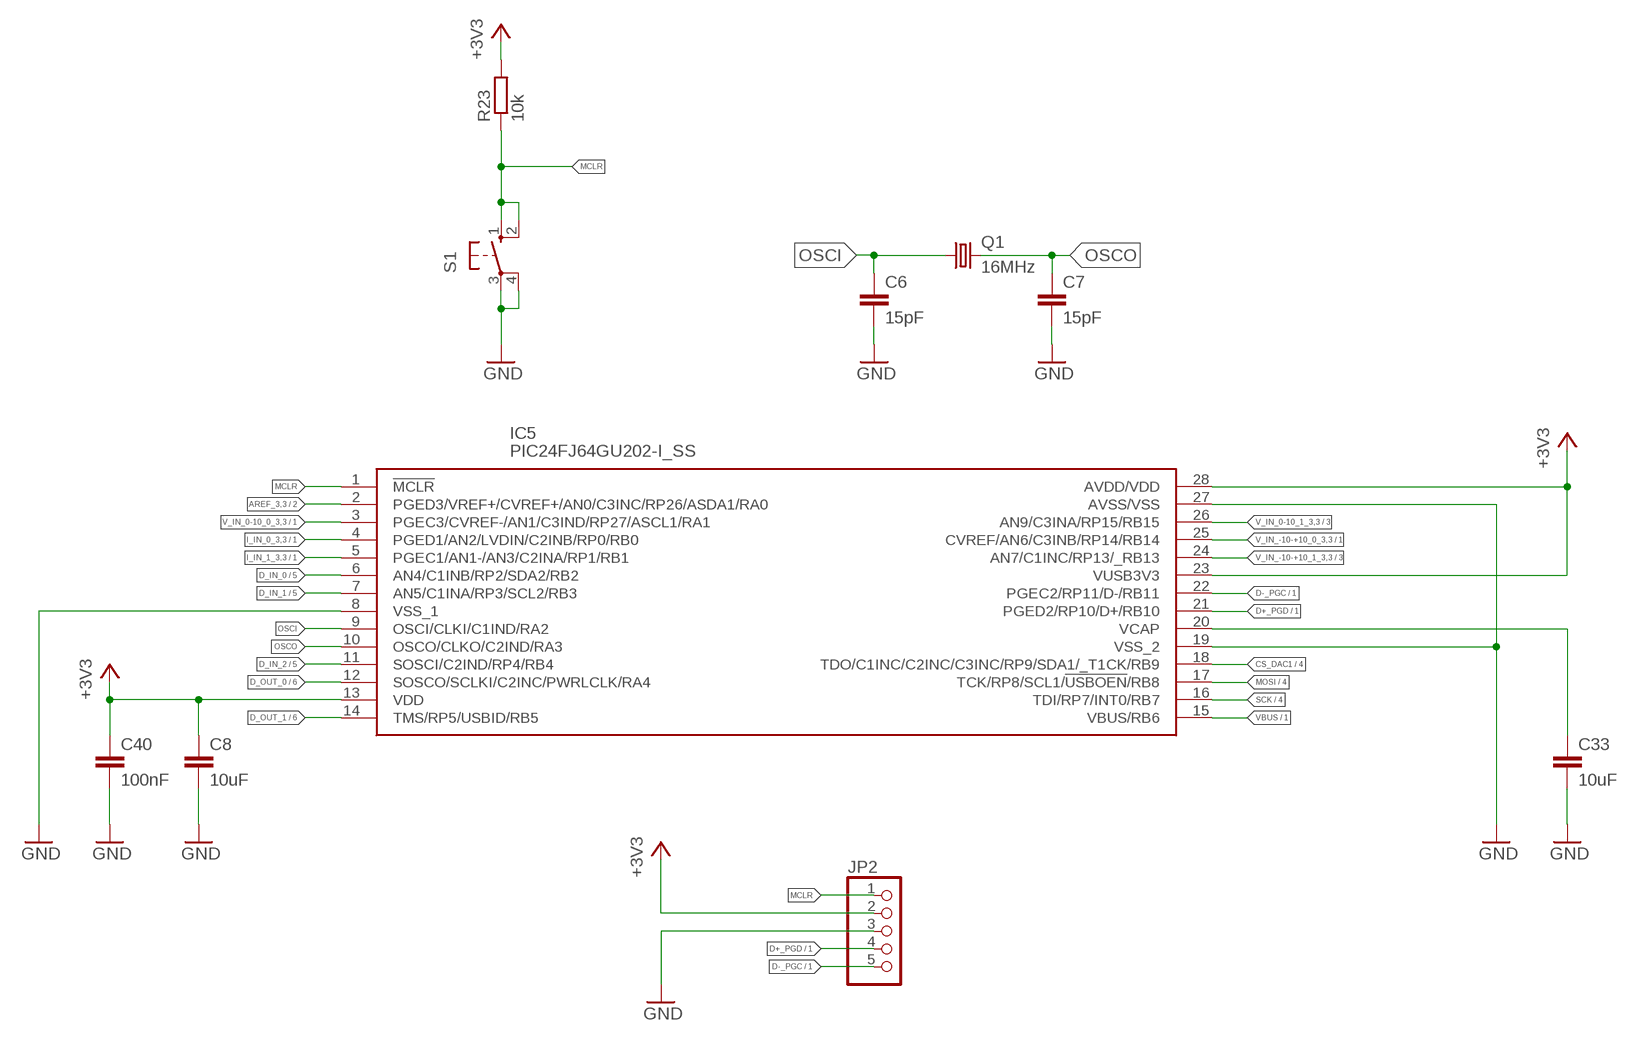
[diagram p7: schematic, sheet 7]

### Parts
C6  15pF  C-EUC0805  [C0805]
C7  15pF  C-EUC0805  [C0805]
C8  10uF  C-EUC0805  [C0805]
C33  10uF  C-EUC0805  [C0805]
C40  100nF  C-EUC0805  [C0805]
IC5  PIC24FJ64GU202-I_SS  [SOP65P780X200-28N]
JP2  PINHD-1X5  [1X05]
Q1  16MHz  CRYSTALHC49U-V  [HC49U-V]
R23  10k  R-EU_R0805  [R0805]
S1  10-XX  [B3F-10XX]

### Nets
+3V3: C8.1 C40.1 IC5.13(VDD) IC5.23(VUSB3V3) IC5.28(AVDD/VDD) JP2.2 R23.2 ; also sheet 8
AREF_3,3: IC5.2(PGED3/VREF+/CVREF+/AN0/C3INC/RP26/ASDA1/RA0) ; also sheet 2,3
CS_DAC1: IC5.18(TDO/C1INC/C2INC/C3INC/RP9/SDA1/_T1CK/RB9) ; also sheet 4
D+_PGD: IC5.21(PGED2/RP10/D+/RB10) JP2.4 ; also sheet 1
D-_PGC: IC5.22(PGEC2/RP11/D-/RB11) JP2.5 ; also sheet 1
D_IN_0: IC5.6(AN4/C1INB/RP2/SDA2/RB2) ; also sheet 5
D_IN_1: IC5.7(AN5/C1INA/RP3/SCL2/RB3) ; also sheet 5
D_IN_2: IC5.11(SOSCI/C2IND/RP4/RB4) ; also sheet 5
D_OUT_0: IC5.12(SOSCO/SCLKI/C2INC/PWRLCLK/RA4) ; also sheet 6
D_OUT_1: IC5.14(TMS/RP5/USBID/RB5) ; also sheet 6
GND: C6.2 C7.2 C8.2 C33.2 C40.2 IC5.8(VSS_1) IC5.19(VSS_2) IC5.27(AVSS/VSS) JP2.3 S1.3(P) S1.4(P1) ; also sheet 1,2,3,4,5,6,8
I_IN_0_3,3: IC5.4(PGED1/AN2/LVDIN/C2INB/RP0/RB0) ; also sheet 1,3
I_IN_1_3,3: IC5.5(PGEC1/AN1-/AN3/C2INA/RP1/RB1) ; also sheet 1,3
MCLR: IC5.1(!MCLR) JP2.1 R23.1 S1.1(S) S1.2(S1)
MOSI: IC5.17(TCK/RP8/SCL1/!USBOEN!/RB8) ; also sheet 4
N$117: C33.1 IC5.20(VCAP)
OSCI: C6.1 IC5.9(OSCI/CLKI/C1IND/RA2) Q1.1
OSCO: C7.1 IC5.10(OSCO/CLKO/C2IND/RA3) Q1.2
SCK: IC5.16(TDI/RP7/INT0/RB7) ; also sheet 4
V_IN_0-10_0_3,3: IC5.3(PGEC3/CVREF-/AN1/C3IND/RP27/ASCL1/RA1) ; also sheet 1,3
V_IN_0-10_1_3,3: IC5.26(AN9/C3INA/RP15/RB15) ; also sheet 3
V_IN_-10-+10_0_3,3: IC5.25(CVREF/AN6/C3INB/RP14/RB14) ; also sheet 1,3
V_IN_-10-+10_1_3,3: IC5.24(AN7/C1INC/RP13/_RB13) ; also sheet 3
VBUS: IC5.15(VBUS/RB6) ; also sheet 1

## Sheet 8 of 8: Power
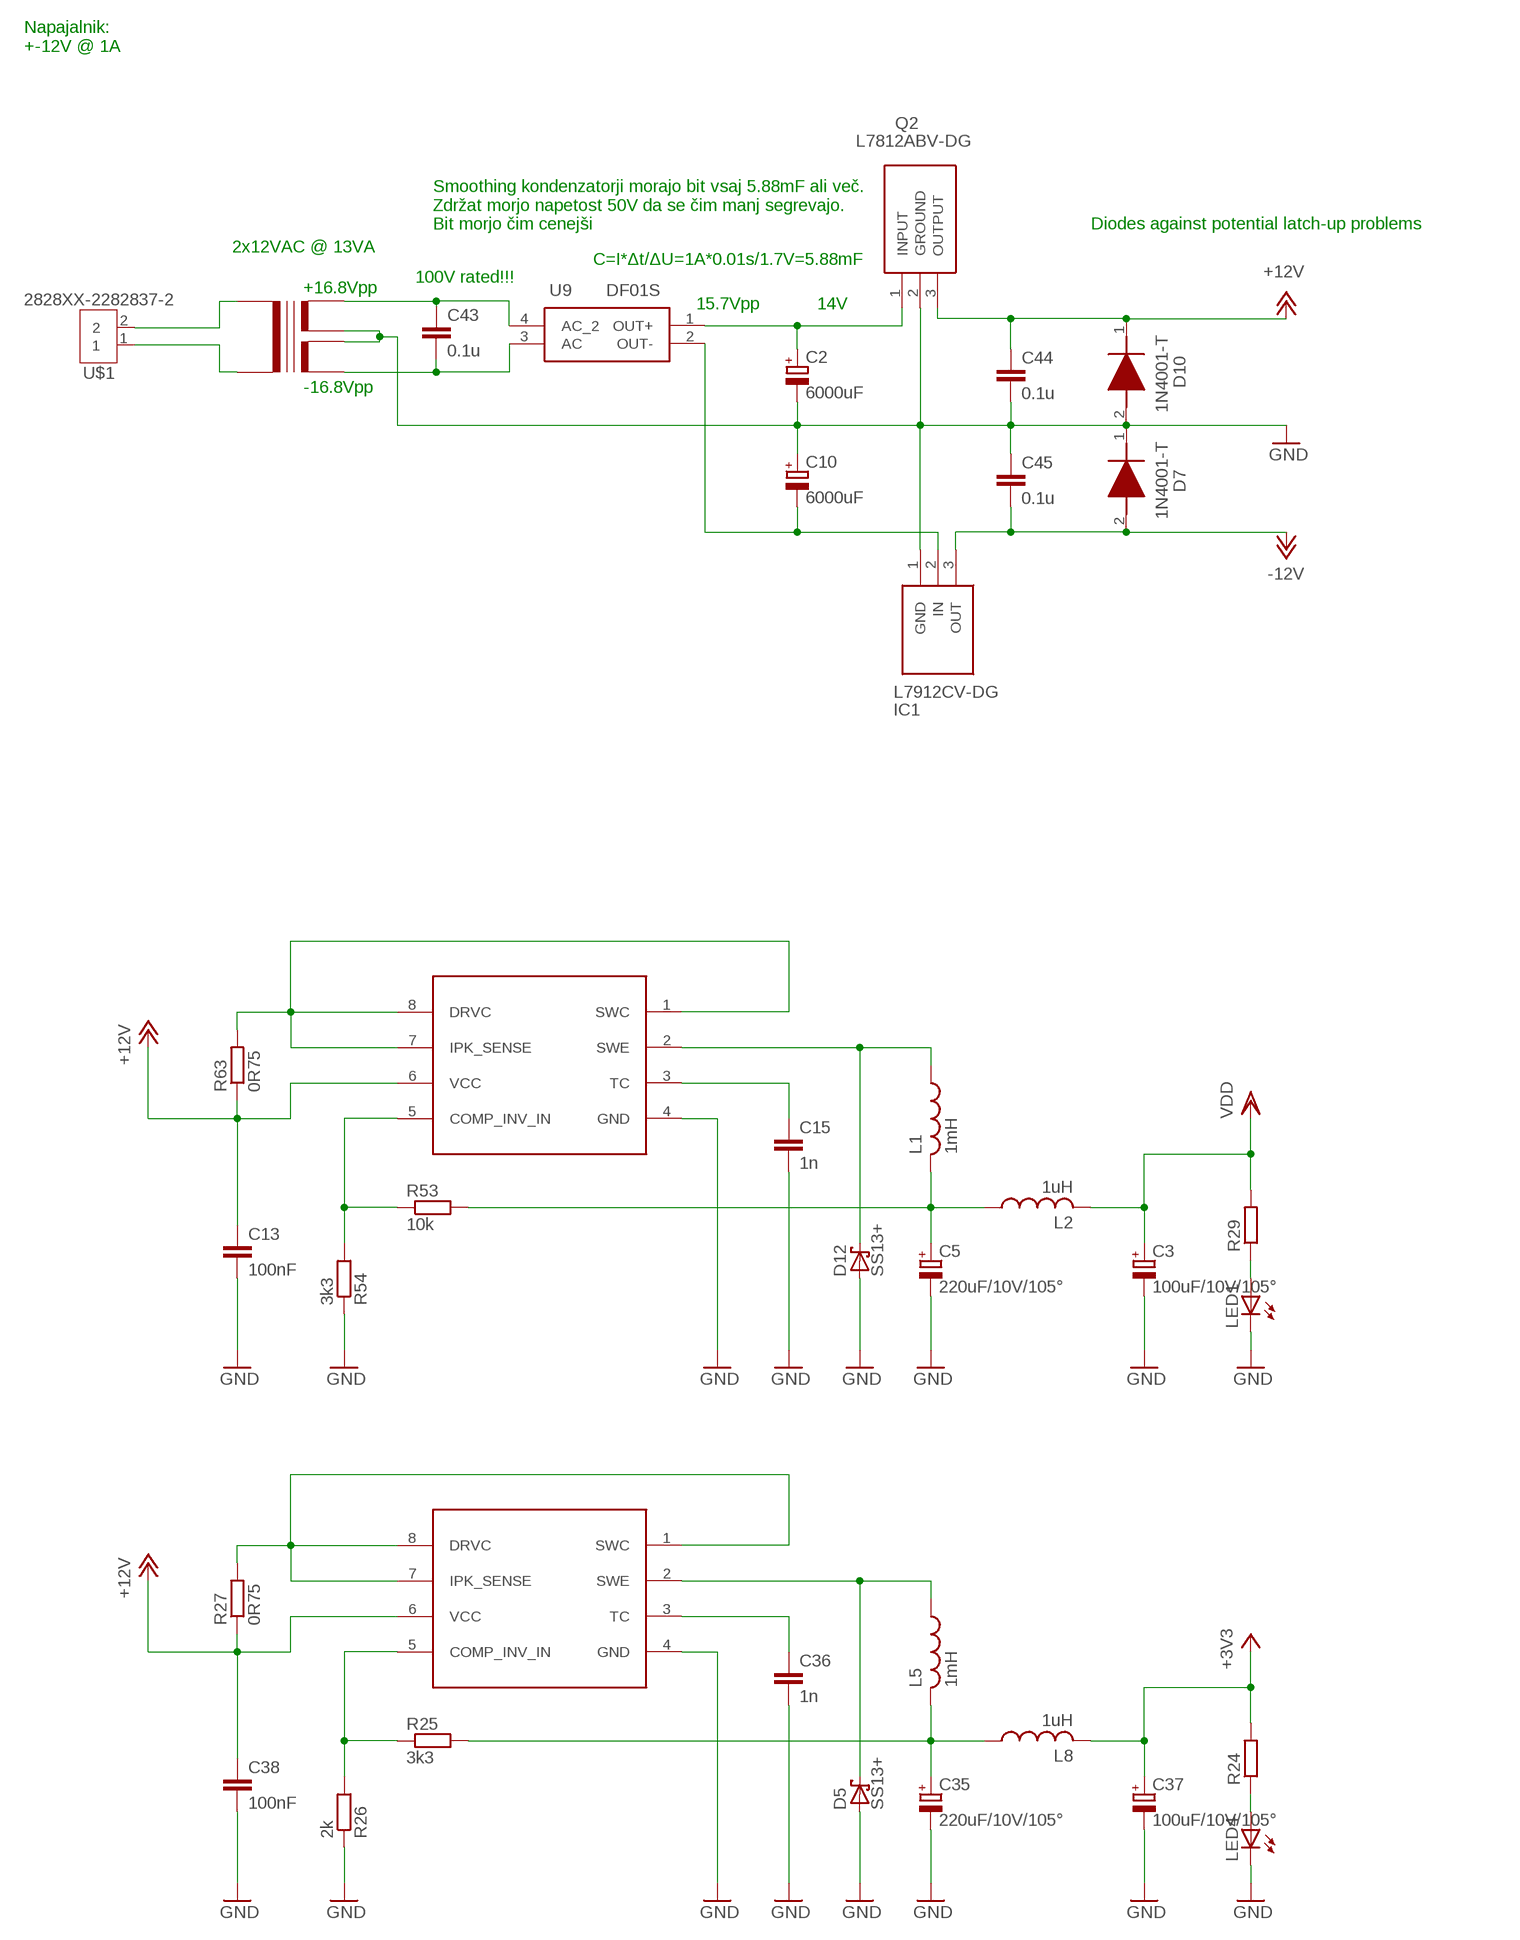
[diagram p8: schematic, sheet 8]

### Parts
C2  6000uF  CPOL-EUE10-22.5  [EB22,5D]
C3  100uF/10V/105°  CPOL-EUE2-5  [E2-5]
C5  220uF/10V/105°  CPOL-EUE2.5-6  [E2,5-6]
C10  6000uF  CPOL-EUE10-22.5  [EB22,5D]
C13  100nF  C-EUC0805  [C0805]
C15  1n  C-EUC0805  [C0805]
C35  220uF/10V/105°  CPOL-EUE2.5-6  [E2,5-6]
C36  1n  C-EUC0805  [C0805]
C37  100uF/10V/105°  CPOL-EUE2-5  [E2-5]
C38  100nF  C-EUC0805  [C0805]
C43  0.1u  C-EUC0805  [C0805]
C44  0.1u  C-EUC0805  [C0805]
C45  0.1u  C-EUC0805  [C0805]
D5  SS13+  SCHOTTKY-DIODESMC  [SMC]
D7  1N4001-T  [DIOAD1408W86L464D236]
D10  1N4001-T  [DIOAD1408W86L464D236]
D12  SS13+  SCHOTTKY-DIODESMC  [SMC]
IC1  L7912CV-DG  [TO255P460X1020X2008-3P]
IC3  AZ34063U  [SO08]
IC7  AZ34063U  [SO08]
L1  1mH  12LRS105C  [12LRS105C]
L2  1uH  INDUCTOR  [R0805]
L5  1mH  12LRS105C  [12LRS105C]
L8  1uH  INDUCTOR  [R0805]
LED1  LED3MM  [LED3MM]
LED4  LED3MM  [LED3MM]
Q2  L7812ABV-DG  [TO255P460X1020X2008-3P]
R24  R-EU_R0805  [R0805]
R25  3k3  R-EU_R0805  [R0805]
R26  2k  R-EU_R0805  [R0805]
R27  0R75  R-EU_R0805  [R0805]
R29  R-EU_R0805  [R0805]
R53  10k  R-EU_R0805  [R0805]
R54  3k3  R-EU_R0805  [R0805]
R63  0R75  R-EU_R0805  [R0805]
TR1  TRANSFORMER-PCB-2X12  [TRANSFORMER-PCB-2X12_FOOTPRINT]
U9  DF01S  [SOT508P985X260-4N]
U$1  2828XX-2282837-2  [TERMBLK_508-2N]

### Nets
+3V3: C37.+ L8.2 R24.2 ; also sheet 7
+5V [signal]: C5.+ L1.3 L2.1 R53.2 ; also sheet 5
+5V3 [signal]: C35.+ L5.3 L8.1 R25.2
+12V: C44.1 D10.1(K) IC3.6(VCC) IC7.6(VCC) Q2.3(OUTPUT) R27.1 R63.1 ; also sheet 1,3,4
-12V: C45.2 D7.2(A) IC1.3(OUT) ; also sheet 3,4
GND: C2.- C3.- C5.- C10.+ C13.2 C15.2 C35.- C36.2 C37.- C38.2 C44.2 C45.1 D5.A D7.1(K) D10.2(A) D12.A IC1.1(GND) IC3.4(GND) IC7.4(GND) LED1.K(C) LED4.K(C) Q2.2(GROUND) R26.1 R54.1 TR1.S12 TR1.S21 ; also sheet 1,2,3,4,5,6,7
N$11 [signal]: LED4.A R24.1
N$15 [signal]: LED1.A R29.1
N$32: IC7.5(COMP_INV_IN) R25.1 R26.2
N$38: IC7.1(SWC) IC7.7(IPK_SENSE) IC7.8(DRVC) R27.2
N$58: D5.C IC7.2(SWE) L5.1
N$60: C36.1 IC7.3(TC)
N$69: C15.1 IC3.3(TC)
N$70: IC3.5(COMP_INV_IN) R53.1 R54.2
N$82: IC3.1(SWC) IC3.7(IPK_SENSE) IC3.8(DRVC) R63.2
N$83: D12.C IC3.2(SWE) L1.1
N$115: TR1.P2 U$1.1
N$119: TR1.P1 U$1.2
N$121: C43.1 TR1.S11 U9.4(AC_2)
N$122: C43.2 TR1.S22 U9.3(AC)
N$124: C2.+ Q2.1(INPUT) U9.1(OUT+)
N$125: C10.- IC1.2(IN) U9.2(OUT-)
VDD: C3.+ L2.2 R29.2 ; also sheet 2,3,4
VDD1: C13.1
VDD2: C38.1

### Notes on the sheet
- Napajalnik:
  +-12V @ 1A
- Smoothing kondenzatorji morajo bit vsaj 5.88mF ali več.
  Zdržat morjo napetost 50V da se čim manj segrevajo.
  Bit morjo čim cenejši
- Diodes against potential latch-up problems
- 2x12VAC @ 13VA
- C=I*Δt/ΔU=1A*0.01s/1.7V=5.88mF
- 100V rated!!!
- +16.8Vpp
- 15.7Vpp | 14V
- -16.8Vpp

## Library data of the parts
C1 C6-C9 C13-C34 C36 C38-C45 = rcl:C-EU: CAPACITOR, European symbol; SPICEPREFIX: C
C2-C5 C10 C35 C37 = rcl:CPOL-EU: POLARIZED CAPACITOR, European symbol; SPICEPREFIX: C
D1 D6 D8 = diode:1N4148: DIODE high speed (Philips)
D3 D4 = diode:BAS40: Silicon Schottky Diodes General-purpose diode for high-speed switching
D5 D12 = diode:SCHOTTKY-DIODE: Schottky Diode
D7 D10 = SamacSys_Parts:1N4001-T: Diode Switching 50V 1A 2Pin DO41 Diodes Inc 1N4001-T Switching Diode, 1A 50V, 2-Pin DO-41 Source: Datasheet <https://datasheet.datasheetarchive.com/originals/distributors/Datasheets-9/DSA-163121.pdf>; ARROW_PART_NUMBER: 1N4001-T; ARROW_PRICE-STOCK: https://www.arrow.com/en/products/1n4001-t/diodes-incorporated?region=nac; DESCRIPTION: Diode Switching 50V 1A 2Pin DO41 Diodes Inc 1N4001-T Switching Diode, 1A 50V, 2-Pin DO-41; HEIGHT: mm; MANUFACTURER_NAME: Diodes Inc.; MANUFACTURER_PART_NUMBER: 1N4001-T; MOUSER_PART_NUMBER: 621-1N4001; MOUSER_PRICE-STOCK: https://www.mouser.co.uk/ProductDetail/Diodes-Incorporated/1N4001-T?qs=e%2FRqmsgwm9i%2FVrrtazegeg%3D%3D
F1 = special:FUSE: FUSE 5 x 20 mm
IC1 = SamacSys_Parts:L7912CV-DG: STMicroelectronics L7912CV-DG, Single Negative Voltage Regulator 1.5A -12.6 V, 3-Pin TO-220 Source: Datasheet <https://media.digikey.com/pdf/Data Sheets/ST Microelectronics PDFS/L79xxC_Rev21_May2012.pdf>; ARROW_PART_NUMBER: L7912CV-DG; ARROW_PRICE-STOCK: https://www.arrow.com/en/products/l7912cv-dg/stmicroelectronics?region=europe; DESCRIPTION: STMicroelectronics L7912CV-DG, Single Negative Voltage Regulator 1.5A -12.6 V, 3-Pin TO-220; HEIGHT: 4.6mm; MANUFACTURER_NAME: STMicroelectronics; MANUFACTURER_PART_NUMBER: L7912CV-DG; MOUSER_PART_NUMBER: 511-L7912CV-DG; MOUSER_PRICE-STOCK: https://www.mouser.co.uk/ProductDetail/STMicroelectronics/L7912CV-DG?qs=T%2FOtf55vL7dJdBu9S2cY8Q%3D%3D
IC3 IC7 = IMPORTED_ELEMENTS:AZ34063U: Switching vlotage regulator Step-up/Step-down/Inverting Up to 180 kHz, 3.0 - 36 V input
IC4 IC6 = linear:LM358: OP AMP also LM158; LM258; LM2904 Source: http://cache.national.com/ds/LM/LM158.pdf
IC5 = SamacSys_Parts:PIC24FJ64GU202-I_SS: 16-bit Microcontrollers - MCU 16-bit, 16 MIPS, 64KB ECC Flash, 8KB RAM, USB, XLP, 28-pin Source: Datasheet <https://ww1.microchip.com/downloads/aemDocuments/documents/MCU16/ProductDocuments/DataSheets/PIC24FJ64GP205-GU205-Family-Data-Sheet-DS30010221C.pdf>; ARROW_PART_NUMBER: PIC24FJ64GU202-I/SS; ARROW_PRICE-STOCK: https://www.arrow.com/en/products/pic24fj64gu202-iss/microchip-technology?region=nac; DESCRIPTION: 16-bit Microcontrollers - MCU 16-bit, 16 MIPS, 64KB ECC Flash, 8KB RAM, USB, XLP, 28-pin; HEIGHT: 2mm; MANUFACTURER_NAME: Microchip; MANUFACTURER_PART_NUMBER: PIC24FJ64GU202-I/SS; MOUSER_PART_NUMBER: 579-24FJ64GU202-I/SS; MOUSER_PRICE-STOCK: https://www.mouser.co.uk/ProductDetail/Microchip-Technology-Atmel/PIC24FJ64GU202-I-SS?qs=W%2FMpXkg%252BdQ7BrfOyOfOM0Q%3D%3D
J1 = IMPORTED:USB-B; COPYRIGHT: Copyright (C) 2022 Ultra Librarian. All rights reserved.; MANUFACTURER_PART_NUMBER: 670688000; MFR_NAME: Molex Connector Corporation
JP1 JP11 = pinhead:PINHD-1X4: PIN HEADER
JP2 JP16 JP17 = pinhead:PINHD-1X5: PIN HEADER
JP3 JP4 = jumper:JP4E: JUMPER
JP12 JP13 = pinhead:PINHD-2X4: PIN HEADER
JP14 JP15 = pinhead:PINHD-2X6: PIN HEADER
L1 L5 = SamacSys_Parts:12LRS105C: Murata 1000 uH +/-15% Radial Inductor, 400mA Idc, 2.3 Rdc 1200LRS Source: Datasheet <https://www.murata-ps.com/data/magnetics/kmp_1200lr.pdf>; ARROW_PART_NUMBER: 12LRS105C; ARROW_PRICE-STOCK: https://www.arrow.com/en/products/12lrs105c/murata-power-solutions; DESCRIPTION: Murata 1000 uH +/-15% Radial Inductor, 400mA Idc, 2.3 Rdc 1200LRS; HEIGHT: 8.5mm; MANUFACTURER_NAME: Murata Electronics; MANUFACTURER_PART_NUMBER: 12LRS105C; MOUSER_PART_NUMBER: 580-12LRS105C; MOUSER_PRICE-STOCK: https://www.mouser.com/Search/Refine.aspx?Keyword=580-12LRS105C
L2 L8 = IMPORTED:INDUCTOR
LED1 LED2 LED4-LED8 = led:LED: LED OSRAM: - CHIPLED LG R971, LG N971, LY N971, LG Q971, LY Q971, LO R971, LY R971 LH N974, LH R974 LS Q976, LO Q976, LY Q976 LO Q996 - Hyper CHIPLED LW Q18S LB Q993, LB Q99A, LB R99A - SideLED LS A670, LO A670, LY A670, LG A670, LP A670 LB A673, LV A673, LT A673, LW A673 LH A674 LY A675 LS A676, LA A676, LO A676, LY A676, LW A676 LS A679, LY A679, LG A679 - Hyper Micro SIDELED® LS Y876, LA Y876, LO Y876, LY Y876 LT Y87S - SmartLED LW L88C, LW L88S LB L89C, LB L89S, LG L890 LS L89K, LO L89K, LY L89K LS L896, LA L896, LO L896, LY L896 - TOPLED LS T670, LO T670, LY T670, LG T670, LP T670 LSG T670, LSP T670, LSY T670, LOP T670, LYG T670 LG T671, LOG T671, LSG T671 LB T673, LV T673, LT T673, LW T673 LH T674 LS T676, LA T676, LO T676, LY T676, LB T676, LH T676, LSB T676, LW T676 LB T67C, LV T67C, LT T67C, LS T67K, LO T67K, LY T67K, LW E67C LS E67B, LA E67B, LO E67B, LY E67B, LB E67C, LV E67C, LT E67C LW T67C LS T679, LY T679, LG T679 LS T770, LO T770, LY T770, LG T770, LP T770 LB T773, LV T773, LT T773, LW T773 LH T774 LS E675, LA E675, LY E675, LS T675 LS T776, LA T776, LO T776, LY T776, LB T776 LHGB T686 LT T68C, LB T68C - Hyper Mini TOPLED® LB M676 - Mini TOPLED Santana® LG M470 LS M47K, LO M47K, LY M47K Source: http://www.osram.convergy.de LUXEON: - LUMILED® LXK2-PW12-R00, LXK2-PW12-S00, LXK2-PW14-U00, LXK2-PW14-V00 LXK2-PM12-R00, LXK2-PM12-S00, LXK2-PM14-U00 LXK2-PE12-Q00, LXK2-PE12-R00, LXK2-PE12-S00, LXK2-PE14-T00, LXK2-PE14-U00 LXK2-PB12-K00, LXK2-PB12-L00, LXK2-PB12-M00, LXK2-PB14-N00, LXK2-PB14-P00, LXK2-PB14-Q00 LXK2-PR12-L00, LXK2-PR12-M00, LXK2-PR14-Q00, LXK2-PR14-R00 LXK2-PD12-Q00, LXK2-PD12-R00, LXK2-PD12-S00 LXK2-PH12-R00, LXK2-PH12-S00 LXK2-PL12-P00, LXK2-PL12-Q00, LXK2-PL12-R00 Source: www.luxeon.com KINGBRIGHT: KA-3528ASYC Source: www.kingbright.com
OK1-OK5 = optocoupler:LTV816: OPTO COUPLER Source: LITEON, LTV816.pdf; OC_FARNELL: unknown; OC_NEWARK: unknown
Q1 = crystal:CRYSTAL: CRYSTAL; OC_FARNELL: 1666969; OC_NEWARK: unknown
Q2 = SamacSys_Parts:L7812ABV-DG: STMICROELECTRONICS - L7812ABV-DG - Linear Voltage Regulator, Fixed, 19V to 35V Input, 12V/1.5A Out, TO-220-3 Source: Datasheet <https://eu.mouser.com/datasheet/2/389/cd00000444-1795274.pdf>; ARROW_PART_NUMBER: L7812ABV-DG; ARROW_PRICE-STOCK: https://www.arrow.com/en/products/l7812abv-dg/stmicroelectronics?region=nac; DESCRIPTION: STMICROELECTRONICS - L7812ABV-DG - Linear Voltage Regulator, Fixed, 19V to 35V Input, 12V/1.5A Out, TO-220-3; HEIGHT: 4.6mm; MANUFACTURER_NAME: STMicroelectronics; MANUFACTURER_PART_NUMBER: L7812ABV-DG; MOUSER_PART_NUMBER: 511-L7812ABV-DG; MOUSER_PRICE-STOCK: https://www.mouser.co.uk/ProductDetail/STMicroelectronics/L7812ABV-DG?qs=gNDSiZmRJS8Nb2k8hIv5aA%3D%3D
R1-R5 R9-R11 R13 R15 R16 R18 R19 R21-R32 R34 R40 R41 R43-R47 R49-R54 R57-R59 R62 R63 R66-R69 R71 R77-R90 R95 R96 R98 R101 R103 = rcl:R-EU_: RESISTOR, European symbol; SPICEPREFIX: R
R6-R8 R20 R39 R42 R48 R72-R76 R91-R94 R99 = pot:TRIM_EU-: POTENTIOMETER
R12 R14 R17 R60 = bourns:3362: 3362 Series 1/4" Square Trimmer
S1 = switch-omron:10-XX: OMRON SWITCH; MPN: B3F-1000; OC_FARNELL: 176432; OC_NEWARK: 36M3542
T1-T4 = transistor:*-NPN-: NPN Transistror BF959 corrected 2008.03.06
TP1-TP5 = testpad:PTR1: TEST PIN
TR1 = DelavnicaCustomComponents:TRANSFORMER-PCB-2X12
U1-U3 U5-U8 U11 U12 = IMPORTED:OP07CD; COPYRIGHT: Copyright (C) 2022 Ultra Librarian. All rights reserved.; MANUFACTURER_PART_NUMBER: OP07CD; MFR_NAME: Texas Instruments
U4 = IMPORTED:MCP1501T-40E/CHY: 4.096 V voltage reference, SOT-23
U9 = SamacSys_Parts:DF01S: DF01S, Bridge Rectifier Single Phase, 1.5A 100V, 4-Pin SDIP Source: Datasheet <http://componentsearchengine.com/Datasheets/1/DF01S.pdf>; ARROW_PART_NUMBER: DF01S; ARROW_PRICE-STOCK: https://www.arrow.com/en/products/df01s/on-semiconductor; DESCRIPTION: DF01S, Bridge Rectifier Single Phase, 1.5A 100V, 4-Pin SDIP; HEIGHT: mm; MANUFACTURER_NAME: onsemi; MANUFACTURER_PART_NUMBER: DF01S; MOUSER_PART_NUMBER: 512-DF01S; MOUSER_PRICE-STOCK: https://www.mouser.co.uk/ProductDetail/ON-Semiconductor-Fairchild/DF01S?qs=jEaxvrTvpae4Dh%252Bb%252BCgJqg%3D%3D
U14 = Microchip_By_element14_Batch_1:MCP4912-E/SL: DAC 10BIT DUAL W/SPI; MPN: MCP4912-E/SL; OC_FARNELL: 1834914; OC_NEWARK: 53R0108; PACKAGE: 14 - SOIC; SUPPLIER: Microchip
U$1 = Connector:2828XX-2: 2 Position Wire to Board Terminal Block Horizontal with Board Datasheet <https://www.te.com.cn/commerce/DocumentDelivery/DDEController?Action=showdoc&DocId=Catalog+Section%7F1308389_EUROSTYLE_TERMINAL_BLOCKS%7F0607%7Fpdf%7FEnglish%7FENG_CS_1308389_EUROSTYLE_TERMINAL_BLOCKS_0607.pdf%7F2-282837-5>; CATEGORY: Connector; DESCRIPTION: 2 Position Wire to Board Terminal Block Horizontal with Board 5.08 mm Through Hole; MANUFACTURER: TE Connectivity; MPN: 282837-2; OPERATING_TEMPERATURE: -40°C to +105°C; PART_STATUS: ACTIVE; ROHS_COMPLIANCE: RoHS Compliant; SERIES: 282837; SUBCATEGORY: Terminal Block; TYPE: Side Wire Entry
X1-X3 = con-phoenix-508:MKDSN1,5/4-5,08: MKDSN 1,5/ 4-5,08 Printklemme Nennstrom: 13,5 A Nennspannung: 250 V Rastermaß: 5,08 mm Polzahl: 4 Anschlussart: Schraubanschluss Montage: Löten Anschlussrichtung Leiter/Platine: 0 ° Artikelnummer: 1729144 Source: http://eshop.phoenixcontact.com .. 1729144.pdf
X4-X7 = con-phoenix-508:MKDSN1,5/2-5,08: MKDSN 1,5/ 2-5,08 Printklemme Nennstrom: 13,5 A Nennspannung: 250 V Rastermaß: 5,08 mm Polzahl: 2 Anschlussart: Schraubanschluss Montage: Löten Anschlussrichtung Leiter/Platine: 0 ° Artikelnummer: 1729128 Source: http://eshop.phoenixcontact.com .. 1729128.pdf
X8 = con-phoenix-508:MKDSN1,5/3-5,08: MKDSN 1,5/ 3-5,08 Printklemme Nennstrom: 13,5 A Nennspannung: 250 V Rastermaß: 5,08 mm Polzahl: 3 Anschlussart: Schraubanschluss Montage: Löten Anschlussrichtung Leiter/Platine: 0 ° Artikelnummer: 1729131 Source: http://eshop.phoenixcontact.com .. 1729131.pdf

## Net classes
0 supply: width 1 mm, clearance 0.3 mm
1 signal: width 0.39 mm, clearance 0.19 mm